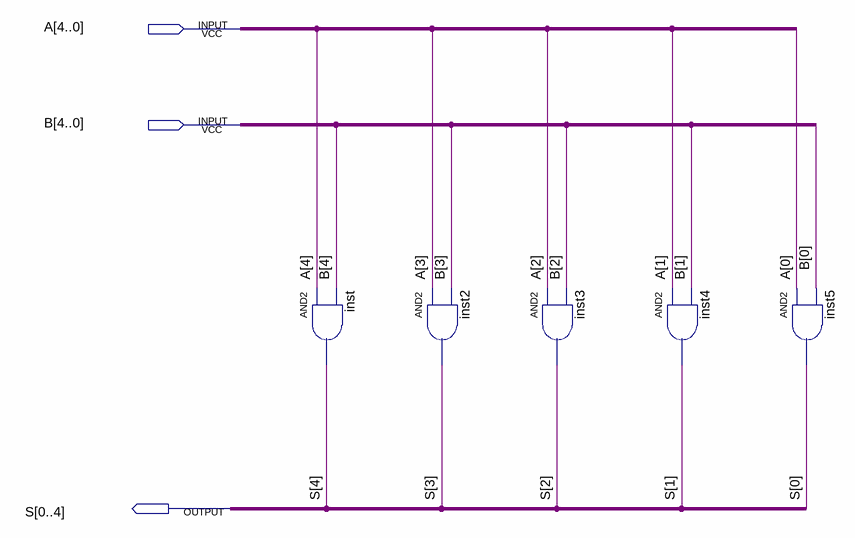
[diagram p0: schematic sheet]
// Quartus schematic OpAnd.bdf as structural Verilog: 5 symbols, 3 pins
module OpAnd (
  input  [4:0] A,
  input  [4:0] B,
  output [0:4] S
);

  and inst (S[4], A[4], B[4]);
  and inst2 (S[3], A[3], B[3]);
  and inst3 (S[2], A[2], B[2]);
  and inst4 (S[1], A[1], B[1]);
  and inst5 (S[0], A[0], B[0]);
endmodule
